# EAGLE schematic MSGP (EAGLE 7.2.0)
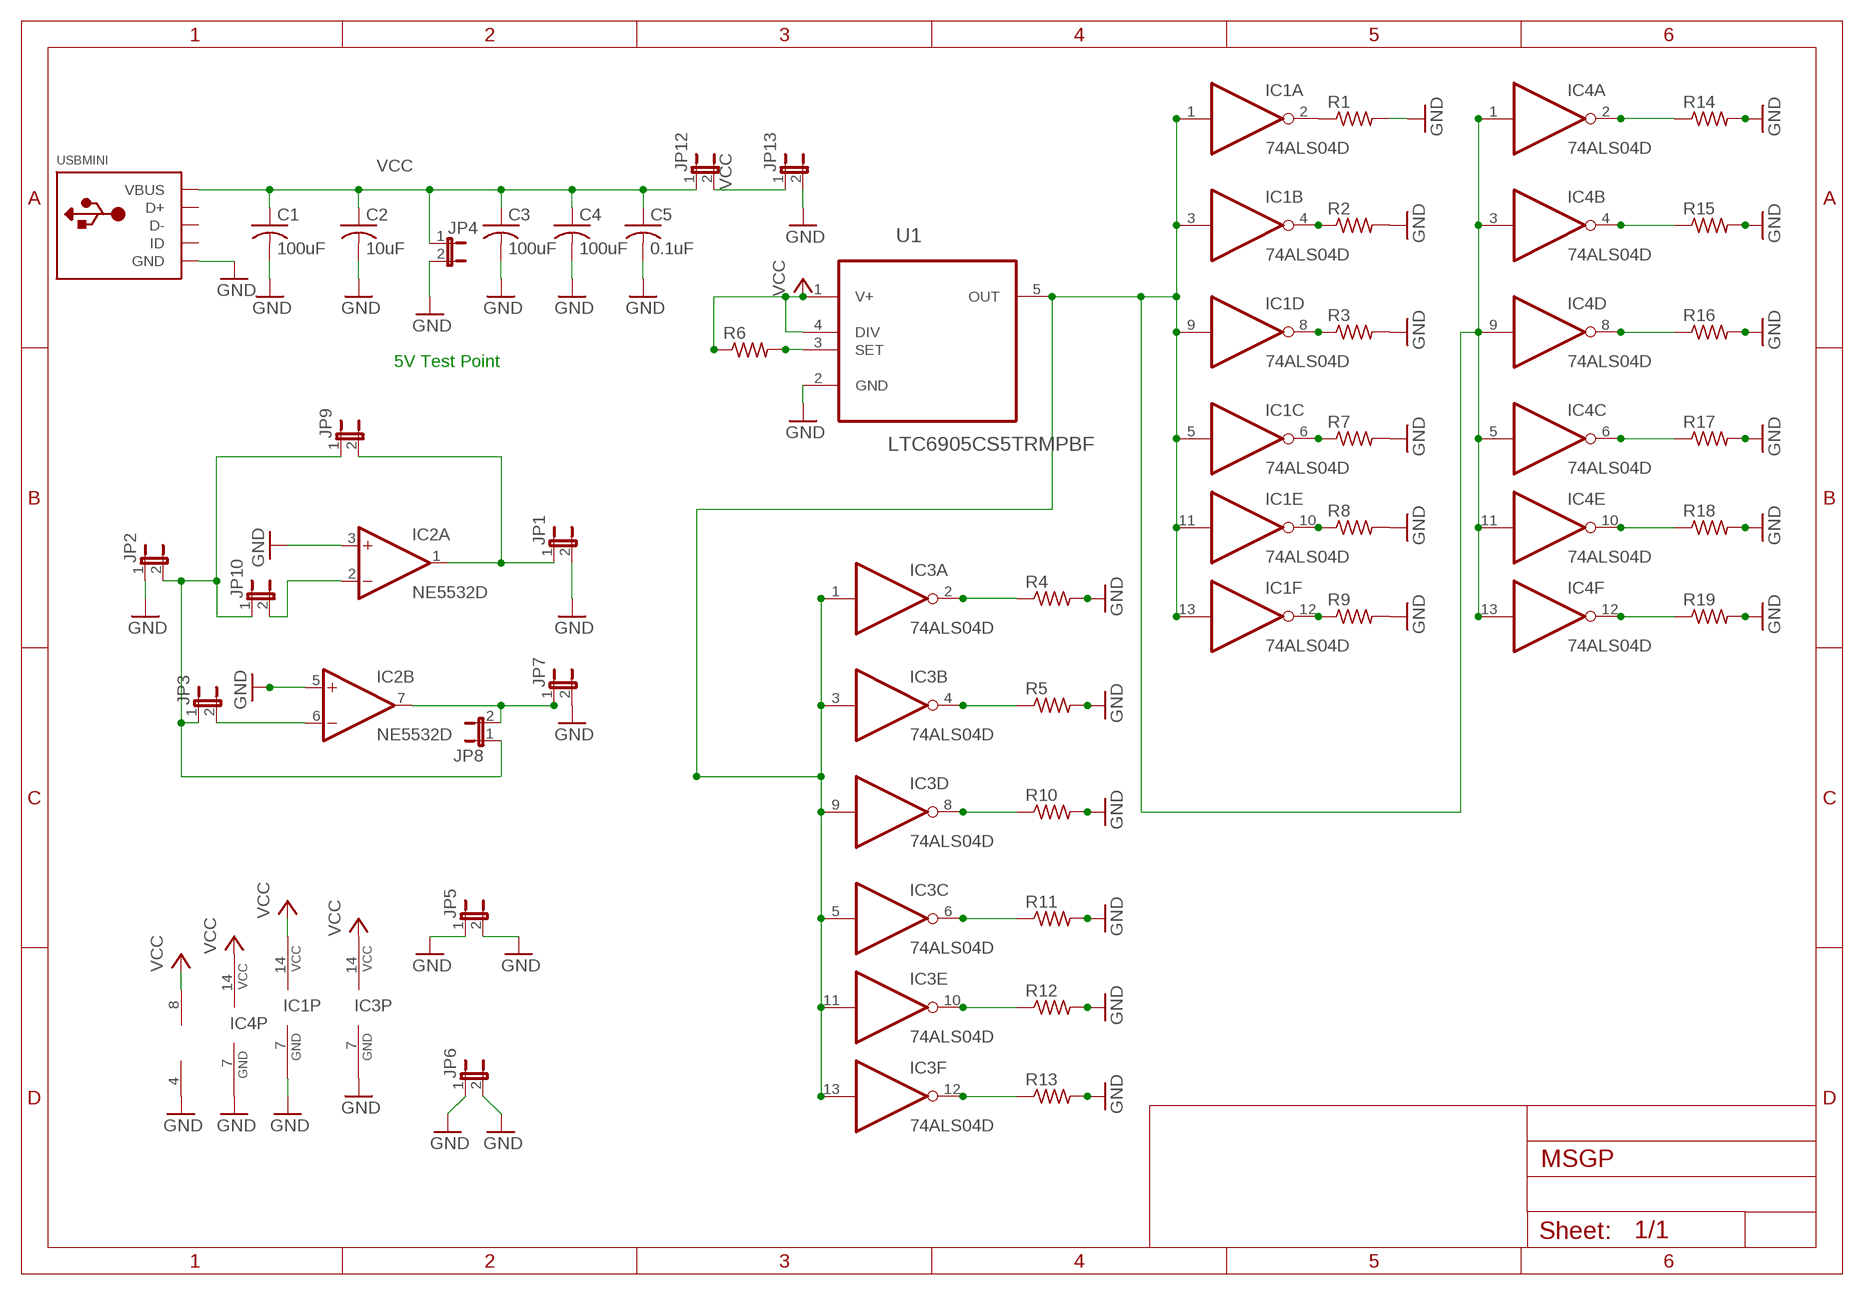
[diagram p0: schematic, sheet 1]

## Parts
C1  100uF  C-USC1206K  [C1206K]
C2  10uF  C-USC1206K  [C1206K]
C3  100uF  C-USC1206K  [C1206K]
C4  100uF  C-USC1206K  [C1206K]
C5  0.1uF  C-USC1206K  [C1206K]
IC1  74ALS04D  [SO14]
IC2  NE5532D  [SO08]
IC3  74ALS04D  [SO14]
IC4  74ALS04D  [SO14]
JP1  JP1E  [JP1]
JP2  JP1E  [JP1]
JP3  JP1E  [JP1]
JP4  JP1E  [JP1]
JP5  JP1E  [JP1]
JP6  JP1E  [JP1]
JP7  JP1E  [JP1]
JP8  JP1E  [JP1]
JP9  JP1E  [JP1]
JP10  JP1E  [JP1]
JP12  JP1E  [JP1]
JP13  JP1E  [JP1]
R1  R-US_0204/2V  [0204V]
R2  R-US_0204/2V  [0204V]
R3  R-US_0204/2V  [0204V]
R4  R-US_0204/2V  [0204V]
R5  R-US_0204/2V  [0204V]
R6  R-US_0204/2V  [0204V]
R7  R-US_0204/2V  [0204V]
R8  R-US_0204/2V  [0204V]
R9  R-US_0204/2V  [0204V]
R10  R-US_0204/2V  [0204V]
R11  R-US_0204/2V  [0204V]
R12  R-US_0204/2V  [0204V]
R13  R-US_0204/2V  [0204V]
R14  R-US_0204/2V  [0204V]
R15  R-US_0204/2V  [0204V]
R16  R-US_0204/2V  [0204V]
R17  R-US_0204/2V  [0204V]
R18  R-US_0204/2V  [0204V]
R19  R-US_0204/2V  [0204V]
U1  LTC6905CS5TRMPBF  [SOT95P280X100-5N]
USBMINI  USBMINIB  [USB-MINIB]

## Nets
GND: C1.2 C2.2 C3.2 C4.2 C5.2 IC1.7(P:GND) IC2.3(A:+IN) IC2.4(P:V-) IC2.5(B:+IN) IC3.7(P:GND) IC4.7(P:GND) JP1.2 JP2.1 JP4.2 JP5.1 JP5.2 JP6.1 JP6.2 JP7.2 JP13.2 R1.2 R2.2 R3.2 R4.2 R5.2 R7.2 R8.2 R9.2 R10.2 R11.2 R12.2 R13.2 R14.2 R15.2 R16.2 R17.2 R18.2 R19.2 U1.2(GND) USBMINI.GND
N$1: IC1.1(A:I) IC1.3(B:I) IC1.5(C:I) IC1.9(D:I) IC1.11(E:I) IC1.13(F:I) IC3.1(A:I) IC3.3(B:I) IC3.5(C:I) IC3.9(D:I) IC3.11(E:I) IC3.13(F:I) IC4.1(A:I) IC4.3(B:I) IC4.5(C:I) IC4.9(D:I) IC4.11(E:I) IC4.13(F:I) U1.5(OUT)
N$2: JP2.2 JP3.1 JP8.1 JP9.1 JP10.1
N$3: IC2.1(A:OUT) JP1.1 JP9.2
N$4: IC1.10(E:O) R8.1
N$5: IC2.2(A:-IN) JP10.2
N$6: R6.2 U1.3(SET)
N$7: IC1.2(A:O) R1.1
N$8: IC1.4(B:O) R2.1
N$9: IC1.8(D:O) R3.1
N$10: IC1.6(C:O) R7.1
N$11: IC1.12(F:O) R9.1
N$12: IC2.7(B:OUT) JP7.1 JP8.2
N$13: IC2.6(B:-IN) JP3.2
N$14: IC3.10(E:O) R12.1
N$16: IC3.2(A:O) R4.1
N$17: IC3.4(B:O) R5.1
N$18: IC3.8(D:O) R10.1
N$19: IC3.6(C:O) R11.1
N$20: IC3.12(F:O) R13.1
N$21: IC4.10(E:O) R18.1
N$23: IC4.2(A:O) R14.1
N$24: IC4.4(B:O) R15.1
N$25: IC4.8(D:O) R16.1
N$26: IC4.6(C:O) R17.1
N$27: IC4.12(F:O) R19.1
VCC: C1.1 C2.1 C3.1 C4.1 C5.1 IC1.14(P:VCC) IC2.8(P:V+) IC3.14(P:VCC) IC4.14(P:VCC) JP4.1 JP12.1 JP12.2 JP13.1 R6.1 U1.1(V+) U1.4(DIV) USBMINI.VBUS
Unconnected: USBMINI.D+ USBMINI.D- USBMINI.ID

## Notes on the sheet
- 5V Test Point

## Library data of the parts
C1-C5 = adafruit:C-US: CAPACITOR, American symbol
IC1 IC3 IC4 = 74xx-us:74*04: Hex INVERTER
IC2 = linear:NE5532: AUDIO AMPLIFIER
JP1-JP10 JP12 JP13 = jumper:JP1E: JUMPER
R1-R19 = resistor:R-US_: RESISTOR, American symbol
U1 = LTC_By_element14_Batch_1:LTC6905CS5TRMPBF: 17MHz to 170MHz Resistor Oscillator; MPN: LTC6905CS5#TRMPBF; OC_FARNELL: 1663923; OC_NEWARK: 19P0750; PACKAGE: SOT-23-5; SUPPLIER: Linear Technology
USBMINI = adafruit:USB: USB Connectors USBMINIB - Surface Mount Female Mini-B USB Connector 4UConnector: 06564 By microbuilder.eu Thru-hole RA Female Mini-B USB Connector 4UConnector: 18732 By ladyada.net